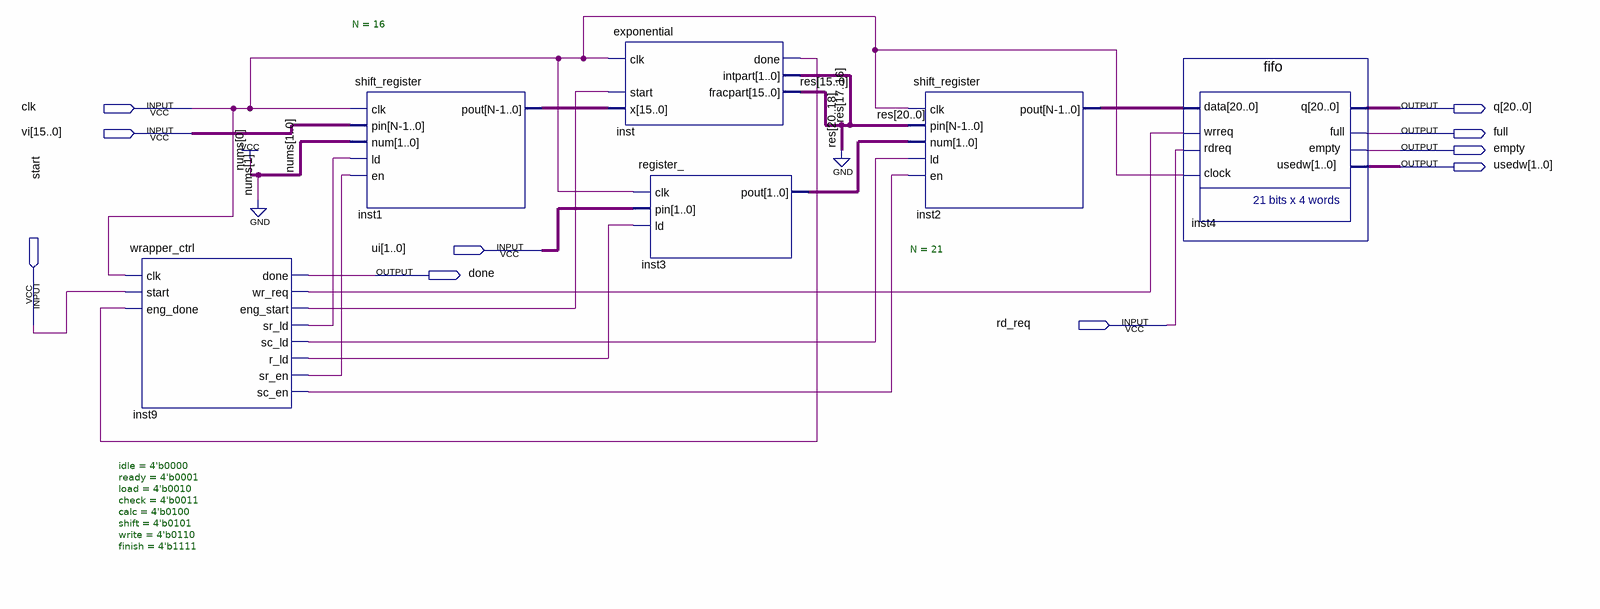
[diagram p0: schematic sheet]
// Quartus schematic wrapper.bdf as structural Verilog: 6 symbols, 10 pins
module wrapper (
  input  clk,
  input  [15:0] vi,
  input  [1:0] ui,
  input  start,
  input  rd_req,
  output [20:0] q,
  output full,
  output empty,
  output [1:0] usedw,
  output done
);

  wire inst9_eng_start, inst9_r_ld, inst9_sc_en, inst9_sc_ld, inst9_sr_en, inst9_sr_ld, inst9_wr_req,
       inst_done;
  wire [1:0] inst3_pout;
  wire [15:0] inst1_pout;
  wire [17:0] res;
  wire [20:0] inst2_pout;

  wrapper_ctrl #(.idle(4'b0000), .ready(4'b0001), .load(4'b0010), .check(4'b0011), .calc(4'b0100), .shift(4'b0101), .write(4'b0110), .finish(4'b1111)) inst9 (
    .clk(clk), .start(start), .eng_done(inst_done), .done(done), .wr_req(inst9_wr_req),
    .eng_start(inst9_eng_start), .sr_ld(inst9_sr_ld), .sc_ld(inst9_sc_ld), .r_ld(inst9_r_ld),
    .sr_en(inst9_sr_en), .sc_en(inst9_sc_en));
  shift_register #(.N(16)) inst1 (
    .clk(clk), .pin(vi), .num(2'b01), .ld(inst9_sr_ld), .en(inst9_sr_en), .pout(inst1_pout));
  exponential inst (
    .clk(clk), .start(inst9_eng_start), .x(inst1_pout), .done(inst_done), .fracpart(res[15:0]),
    .intpart(res[17:16]));
  register_ inst3 (.clk(clk), .pin(ui), .ld(inst9_r_ld), .pout(inst3_pout));
  shift_register #(.N(21)) inst2 (
    .clk(clk), .pin({3'b000, res}), .num(inst3_pout), .ld(inst9_sc_ld), .en(inst9_sc_en), .pout(inst2_pout));
  fifo inst4 (
    .data(inst2_pout), .wrreq(inst9_wr_req), .rdreq(rd_req), .clock(clk), .q(q), .full(full), .empty(empty),
    .usedw(usedw));
endmodule
